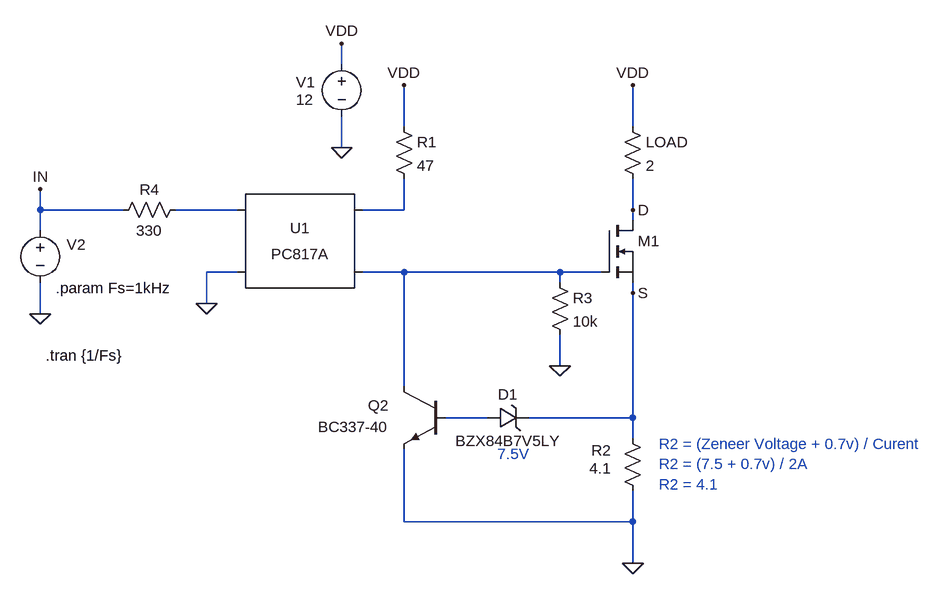
[diagram p0: schematic v2.1.asc]
v2.1.asc, the LTspice schematic file:
Version 4.1
SHEET 1 1096 964
WIRE 160 144 160 112
WIRE 256 240 256 176
WIRE 608 240 608 176
WIRE 160 272 160 224
WIRE -304 368 -304 336
WIRE -176 368 -304 368
WIRE 0 368 -96 368
WIRE 256 368 256 320
WIRE 256 368 192 368
WIRE 608 368 608 320
WIRE 608 384 608 368
WIRE -304 400 -304 368
WIRE 0 464 -48 464
WIRE 256 464 192 464
WIRE 496 464 256 464
WIRE 560 464 496 464
WIRE 496 480 496 464
WIRE 608 496 608 480
WIRE -48 512 -48 464
WIRE -304 528 -304 480
WIRE 496 608 496 560
WIRE 256 640 256 464
WIRE 384 688 320 688
WIRE 608 688 608 496
WIRE 608 688 448 688
WIRE 608 720 608 688
WIRE 256 848 256 736
WIRE 608 848 608 800
WIRE 608 848 256 848
WIRE 608 912 608 848
FLAG 160 272 0
FLAG 608 912 0
FLAG 496 608 0
FLAG 160 112 VDD
FLAG 608 176 VDD
FLAG -48 512 0
FLAG -304 528 0
FLAG -304 336 IN
FLAG 256 176 VDD
FLAG 608 496 S
FLAG 608 368 D
SYMBOL voltage 160 128 R0
WINDOW 0 -70 43 Left 2
WINDOW 3 -70 70 Left 2
WINDOW 123 0 0 Left 0
WINDOW 39 0 0 Left 0
SYMATTR InstName V1
SYMATTR Value 12
SYMBOL res 240 224 R0
SYMATTR InstName R1
SYMATTR Value 47
SYMBOL npn 320 640 M0
WINDOW 0 87 29 Left 2
WINDOW 3 88 62 Left 2
SYMATTR InstName Q2
SYMATTR Value BC337-40
SYMBOL res 592 704 R0
WINDOW 0 -48 34 Left 2
WINDOW 3 -51 62 Left 2
SYMATTR InstName R2
SYMATTR Value 4.1
SYMBOL res 592 224 R0
SYMATTR InstName LOAD
SYMATTR Value 2
SYMBOL nmos 560 384 R0
WINDOW 3 56 72 Invisible 2
SYMATTR Value PSMN1R025YLD
SYMATTR InstName M1
SYMBOL res 480 464 R0
SYMATTR InstName R3
SYMATTR Value 10k
SYMBOL Optos\\PC817A 96 416 R0
SYMATTR InstName U1
SYMBOL res -192 384 R270
WINDOW 0 32 56 VTop 2
WINDOW 3 0 56 VBottom 2
SYMATTR InstName R4
SYMATTR Value 330
SYMBOL voltage -304 384 R0
WINDOW 0 41 37 Left 2
WINDOW 3 -45 -10 Invisible 2
WINDOW 123 0 0 Left 0
WINDOW 39 0 0 Left 0
SYMATTR InstName V2
SYMATTR Value PULSE(0 3.3 0 {0.01/Fs} {0.01/Fs} {0.5/Fs} {1/Fs})
SYMBOL zener 384 704 R270
WINDOW 0 36 32 VTop 2
WINDOW 3 -4 32 VBottom 2
SYMATTR InstName D1
SYMATTR Value BZX84B7V5LY
TEXT -296 592 Left 2 !.tran {1/Fs}
TEXT 648 728 Left 2 ;R2 = (Zeneer Voltage + 0.7v) / Curent\nR2 = (7.5 + 0.7v) / 2A\nR2 = 4.1
TEXT -280 488 Left 2 !.param Fs=1kHz
TEXT 400 744 Left 2 ;7.5V

The netlist it stands for:
* v2.1.asc
V1 VDD 0 12
R1 VDD N002 47
Q2 N003 N004 0 0 BC337-40
R2 S 0 4.1
R§LOAD VDD D 2
M1 D N003 S S PSMN1R025YLD
R3 N003 0 10k
X§U1 N001 0 N002 N003 PC817 Igain=1m
R4 IN N001 330
V2 IN 0 PULSE(0 3.3 0 {0.01/Fs} {0.01/Fs} {0.5/Fs} {1/Fs})
D1 N004 S BZX84B7V5LY
.model D D
.lib standard.dio
.model NPN NPN
.model PNP PNP
.lib standard.bjt
.model NMOS NMOS
.model PMOS PMOS
.lib standard.mos
.tran {1/Fs}
* R2 = (Zeneer Voltage + 0.7v) / Curent
* R2 = (7.5 + 0.7v) / 2A
* R2 = 4.1
.param Fs=1kHz
* 7.5V
.lib PC817.sub
.backanno
.end

* Results of the author's LTspice run, read from the files saved beside the schematic
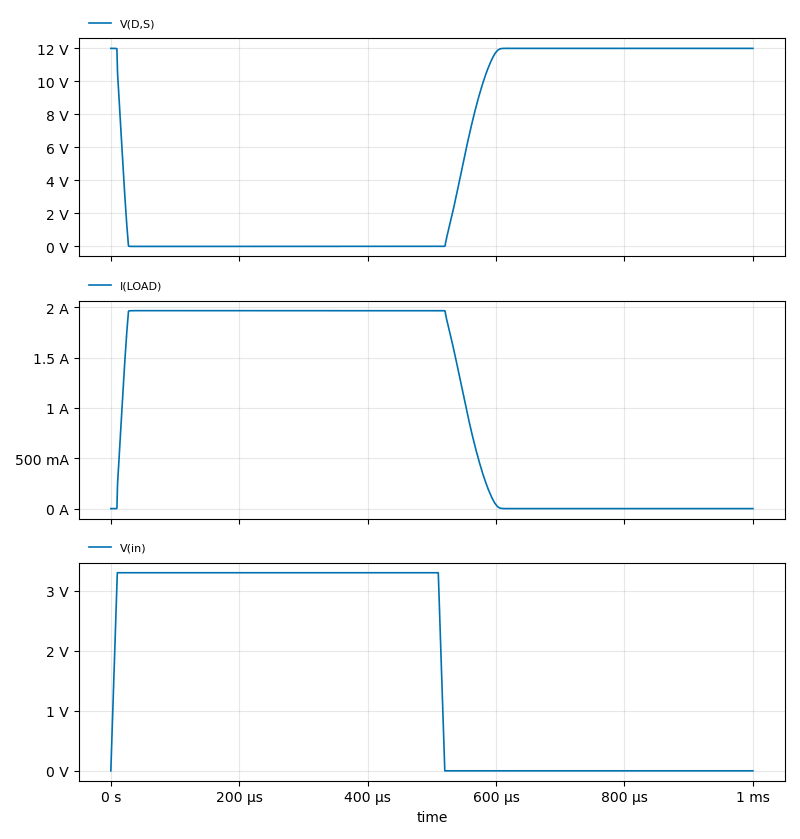
[diagram p1: Transient Analysis of v2.1.asc, plotted from the saved traces]
* Transient Analysis, 1 run:
*   V(D,S): min 2.597 mV, max 12 V, average 5.541 V, rms 8.014 V, last 12 V
*   I(LOAD): min -321.5 µA, max 1.968 A, average 1.059 A, rms 1.422 A, last -1.904 µA
*   V(in): min 0 V, max 3.3 V, average 1.683 V, rms 2.349 V, last 0 V